# EAGLE design M_A_jumper_bed (EAGLE 9.6.2)
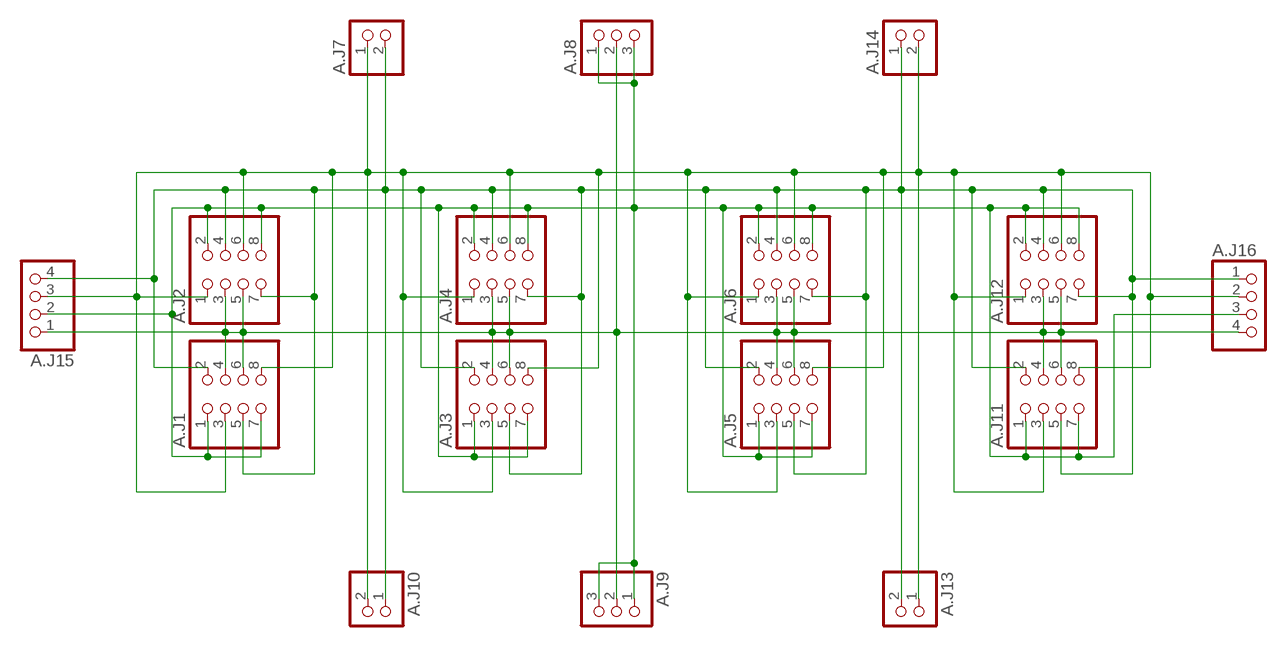
[diagram p0: schematic, sheet 1]

## Parts
A.J1  PINHD-2X4  [2X04]
A.J2  PINHD-2X4  [2X04]
A.J3  PINHD-2X4  [2X04]
A.J4  PINHD-2X4  [2X04]
A.J5  PINHD-2X4  [2X04]
A.J6  PINHD-2X4  [2X04]
A.J7  PINHD-1X2/90  [1X02/90]
A.J8  PINHD-1X3/90  [1X03/90]
A.J9  PINHD-1X31X03/90F  [1X03/90F]
A.J10  PINHD-1X21X02/90F  [1X02/90F]
A.J11  PINHD-2X4  [2X04]
A.J12  PINHD-2X4  [2X04]
A.J13  PINHD-1X21X02/90F  [1X02/90F]
A.J14  PINHD-1X2/90  [1X02/90]
A.J15  PINHD-1X4  [1X04]
A.J16  PINHD-1X4  [1X04]

## Nets
GND: A.J1.1 A.J1.7 A.J2.2 A.J2.8 A.J3.1 A.J3.7 A.J4.2 A.J4.8 A.J5.1 A.J5.7 A.J6.2 A.J6.8 A.J8.1 A.J8.3 A.J9.1 A.J9.3 A.J11.1 A.J11.7 A.J12.2 A.J12.8 A.J15.2 A.J16.3
SCL: A.J1.2 A.J1.5 A.J2.4 A.J2.7 A.J3.2 A.J3.5 A.J4.4 A.J4.7 A.J5.2 A.J5.5 A.J6.4 A.J6.7 A.J7.2 A.J10.1 A.J11.2 A.J11.5 A.J12.4 A.J12.7 A.J13.2 A.J14.1 A.J15.4 A.J16.1
SDA: A.J1.3 A.J1.8 A.J2.1 A.J2.6 A.J3.3 A.J3.8 A.J4.1 A.J4.6 A.J5.3 A.J5.8 A.J6.1 A.J6.6 A.J7.1 A.J10.2 A.J11.3 A.J11.8 A.J12.1 A.J12.6 A.J13.1 A.J14.2 A.J15.3 A.J16.2
VCC: A.J1.4 A.J1.6 A.J2.3 A.J2.5 A.J3.4 A.J3.6 A.J4.3 A.J4.5 A.J5.4 A.J5.6 A.J6.3 A.J6.5 A.J8.2 A.J9.2 A.J11.4 A.J11.6 A.J12.3 A.J12.5 A.J15.1 A.J16.4

## Library data of the parts
A.J1-A.J6 A.J11 A.J12 = pinhead2:PINHD-2X4: PIN HEADER
A.J7 A.J10 A.J13 A.J14 = pinhead2:PINHD-1X2: PIN HEADER
A.J8 A.J9 = pinhead2:PINHD-1X3: PIN HEADER
A.J15 A.J16 = pinhead2:PINHD-1X4: PIN HEADER

## Board
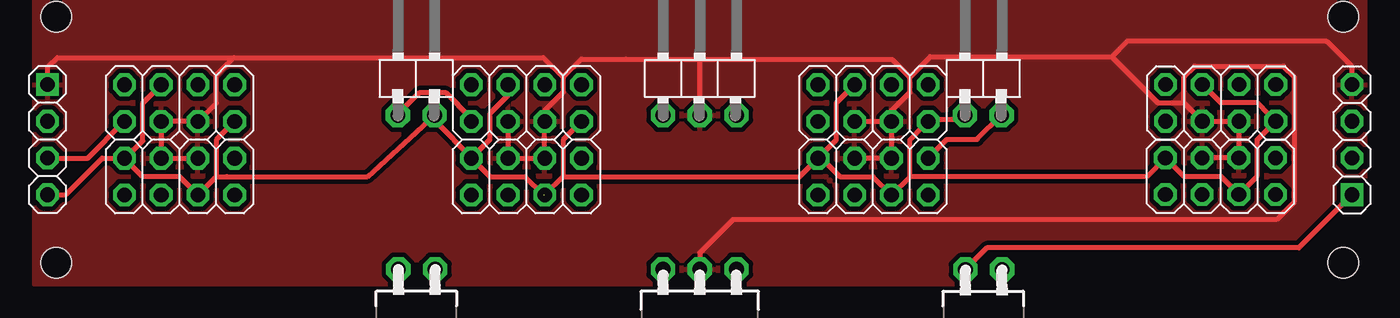
[diagram p1: board, top side]
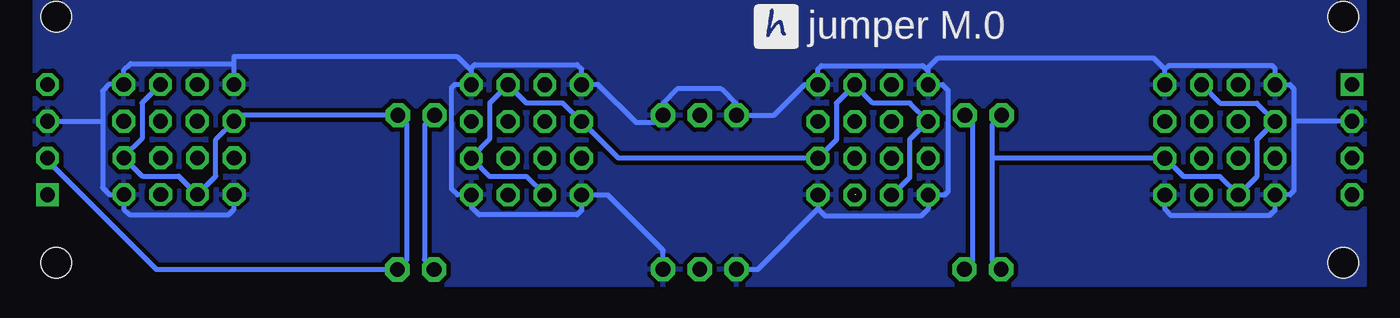
[diagram p2: board, bottom side, seen from below]

No outline drawn. Coordinates in mm, seen from the top.
Copper layers (1*16): Top 0.035mm / dielectric 1.5mm / Bottom 0.035mm
Design rules "default *": minimum track width 12mil, minimum drill 0.35mm, track to track 12mil, track to pad 12mil, pad to pad 12mil, via to via 12mil, smd to smd 12mil, copper to edge 0mil, drill to drill 15mil, minimum pad ring 10mil, minimum via ring 8mil, stop-mask expansion 4mil, vias tented up to drill 0mil, thermal gap 10mil
Holes 2.1 mm at 91,2 91,19 2,19 2,2

### Footprints (pad centres in the part's own frame; a part is rotated, then mirrored left to right if it is on the bottom)
2X04 = drill 1.016 pad 1.575 octagon: 1 -3.81,-1.27; 2 -3.81,1.27; 3 -1.27,-1.27; 4 -1.27,1.27; 5 1.27,-1.27; 6 1.27,1.27; 7 3.81,-1.27; 8 3.81,1.27
1X02/90 = drill 1.016 pad 1.676 octagon: 1 -1.27,-3.81; 2 1.27,-3.81
1X03/90 = drill 1.016 pad 1.676 octagon: 1 -2.54,-3.81; 2 0,-3.81; 3 2.54,-3.81
1X03/90F = drill 1.016 pad 1.676 octagon: 1 -2.54,0; 2 0,0; 3 2.54,0
1X02/90F = drill 1.016 pad 1.676 octagon: 1 -1.31,0; 2 1.23,0
1X04 = drill 1.016 pad 1.575 square: 1 -3.81,0 | drill 1.016 pad 1.575 octagon: 2 -1.27,0; 3 1.27,0; 4 3.81,0

### Placement (x,y rotation side)
A.J1  10.52,13.03 180 top
A.J2  10.52,7.95 180 top
A.J3  34.51,13.03 180 top
A.J4  34.51,7.95 180 top
A.J5  58.48,13.03 180 top
A.J6  58.48,7.95 180 top
A.J7  26.89,16 0 top
A.J8  46.5,16 0 top
A.J9  46.5,1.54 180 top
A.J10  26.89,1.54 180 top
A.J11  82.51,7.97 0 top
A.J12  82.52,13.05 0 top
A.J13  66.1,1.52 180 top
A.J14  66.1,16 0 top
A.J15  1.4,10.5 270 top
A.J16  91.6,10.5 90 top

### Tracks (layer width: path | path; a pad name or v marks a point on that pad's centre or on a via)
GND
  Bottom 0.356: A.J5.7 54.67,15.39 54.98,15.69 62.06,15.69 62.39,15.36 | A.J5.7 54.67,14.88 | A.J3.7 30.7,15.24 30.81,15.35 | 30.81,15.35 31.08,15.62 38.09,15.62 38.32,15.39 A.J3.1 39.26,14.3 41.37,12.19 A.J8.1 43.96,12.96 45.01,14.01 48.06,14.01 49.04,13.03 A.J8.3 49.54,11.69 50.92,11.69 53.53,14.3 A.J5.7 | A.J3.7 29.71,14.3 29.33,13.91 29.33,6.91 29.56,6.68 A.J4.8 30.7,5.71 31.18,5.23 37.84,5.23 38.32,5.71 | A.J1.1 14.33,15.35 | 14.33,15.35 14.07,15.62 6.92,15.62 6.71,15.41 A.J1.7 5.7,14.3 5.41,14 5.41,11.79 | 14.35,5.76 14.33,5.8 A.J2.2 14.33,5.67 13.91,5.25 7.11,5.25 6.71,5.65 A.J2.8 5.7,6.68 5.41,6.97 5.41,9.22 | 5.41,11.79 5.41,9.22 | A.J4.2 38.32,5.71 | A.J6.8 54.67,5.61 54.98,5.3 61.76,5.3 62.29,5.84 A.J6.2 63.26,6.68 63.66,7.08 63.66,14.09 63.46,14.3 A.J5.1 62.29,15.26 62.39,15.36 | A.J6.8 54.67,6.04 | A.J3.7 30.7,15.31 | 30.81,15.35 30.02,16.15 15.13,16.15 14.33,15.35 | A.J12.2 78.71,15.76 | 78.71,15.76 78.71,16.26 63.29,16.26 62.39,15.36 | 87.8,11.68 87.8,13.88 87.36,14.31 A.J12.8 86.33,15.31 85.88,15.76 78.71,15.76 | 87.8,11.68 87.8,7.18 87.32,6.7 A.J11.7 86.32,5.7 85.93,5.31 79.09,5.31 78.7,5.7 A.J11.1 | A.J9.3 42.49,1.54 38.32,5.71 | A.J9.1 49.04,2.85 52.87,6.68 A.J6.8 | 5.4,9.23 5.41,9.22 | A.J15.2 5.39,11.77 5.41,11.79 | A.J16.3 87.89,11.77 87.8,11.68
  pour Bottom: 92.5,0.5 0.5,0.5 0.5,20.5 92.5,20.5
SCL  (1 unrouted)
  Top 0.356: 35.7,6.71 35.65,6.73 34.43,7.95 31.99,7.95 30.72,9.22 A.J4.7 | A.J4.7 30.7,9.16 | A.J6.7 55.94,10.49 55.94,13.04 A.J5.5 | 61.02,7.95 A.J6.4 58.48,7.95 56.19,7.95 54.91,9.22 A.J6.7 | 62.29,11.74 A.J5.2 | 61.02,7.95 61.02,10.47 61.98,11.43 62.26,11.43 62.29,11.46 A.J5.2 | A.J12.4 82.52,13.04 85.08,13.04 85.86,12.26 85.86,12.24 A.J12.7 85.05,10.5 85.05,7.97 A.J11.5 83.78,6.72 82.53,7.97 79.97,7.97 A.J11.2 77.4,7.95 61.02,7.95 | A.J1.2 13.06,10.49 13.06,7.93 | 13.06,7.93 11.81,6.68 A.J2.4 11.79,6.69 10.54,7.95 7.98,7.95 A.J2.7 | A.J1.5 7.98,13.03 7.98,10.42 6.78,9.22 A.J2.7 | A.J3.2 37.05,10.49 37.05,7.95 | A.J3.5 33.24,13.55 31.97,12.28 31.97,10.49 A.J4.7 | 13.06,7.93 13.79,7.93 13.81,7.95 23.53,7.95 A.J7.2 28.16,11.69 28.3,11.69 30.7,9.29 A.J4.7 | 37.05,7.95 A.J4.4 | A.J14.1 64.83,11.86 62.39,11.86 A.J5.2 | A.J13.2 66.37,3.02 87.93,3.02 A.J16.1 | A.J15.4 2.65,6.69 5.18,9.22 A.J2.7 | A.J6.7 53.4,7.95 37.05,7.95
  Bottom 0.356: A.J13.2 65.52,2.18 65.51,2.27 65.51,11.51 65.52,11.51 A.J14.1 | A.J7.2 27.64,11.67 27.64,2.1 A.J10.1
SDA
  Top 0.356: A.J14.2 67.35,12.19 65.68,10.51 63.59,10.51 A.J6.1 | A.J3.8 30.7,11.97 28.95,13.73 27.1,13.73 25.62,12.25 A.J7.1 | A.J15.3 4.19,9.23 A.J1.8
  Bottom 0.356: 9.28,6.68 A.J2.6 | A.J4.6 33.19,6.68 31.97,7.89 31.97,10.51 30.72,11.76 A.J3.8 30.7,11.77 31.95,13.03 34.51,13.03 A.J3.3 35.78,14.29 37.05,13.02 37.05,10.49 A.J4.1 52.13,9.22 A.J5.8 54.7,11.76 55.97,13.03 58.48,13.03 A.J5.3 61.02,13.03 61.02,10.57 62.29,9.3 A.J6.1 61.02,7.95 58.48,7.95 A.J6.6 | A.J12.6 85.06,13.04 85.06,10.56 86.32,9.3 A.J11.8 85.05,7.97 82.52,7.97 A.J11.3 79.97,7.97 79.97,10.52 A.J12.1 78.71,11.8 78.32,12.19 A.J14.2 66.75,11.57 66.75,2.18 A.J13.1 84.08,1.52 91.6,9.04 A.J16.2 | A.J1.3 10.52,13.03 7.97,13.03 6.71,11.77 A.J1.8 7.98,10.49 7.98,7.93 9.24,6.68 A.J2.6 | A.J2.6 10.52,7.95 13.03,7.95 14.3,9.22 A.J2.1 26.29,9.22 26.3,9.22 | A.J10.2 26.3,2.17 26.3,9.22 | 26.3,9.22 26.3,11.52 A.J7.1
VCC
  Top 0.356: A.J2.5 A.J1.6 A.J1.4 13.06,13.03 13.06,14.96 14.28,16.18 | A.J2.5 | A.J2.5 A.J2.3 | A.J5.6 A.J5.4 | A.J5.4 A.J6.3 A.J6.5 | A.J3.6 A.J4.5 A.J4.3 A.J3.4 35.78,12.5 37.05,13.77 37.05,14.82 36.94,14.94 | A.J11.4 A.J11.6 A.J12.5 A.J12.3 79.98,13.04 | 79.98,13.04 78.18,13.04 74.98,16.24 | A.J5.4 59.75,12.5 61.02,13.77 61.02,14.82 | 14.28,16.18 35.69,16.18 36.94,14.94 | 36.94,14.94 37.16,14.94 38.29,16.07 41.4,16.07 41.44,16.03 46.5,16.03 | 61.02,14.82 59.81,16.03 46.5,16.03 | 61.02,14.82 62.44,16.24 74.98,16.24 | A.J8.2 46.5,16.03 | 79.98,13.04 79.98,14.84 80.72,15.59 86.85,15.59 87.6,14.84 87.6,6.18 86.39,4.98 48.79,4.98 46.5,2.69 A.J9.2 | A.J15.1 1.4,15.48 1.41,15.5 2.09,16.18 14.28,16.18 | A.J16.4 91.58,14.34 91.58,15.56 89.84,17.3 76.04,17.3 74.98,16.24
  pour Top: 0.5,20.5 92.5,20.5 92.5,0.5 0.5,0.5

### Text on the board
bPlace: jumper M.0